# EAGLE design Dicio_bkup (EAGLE 7.5.0)
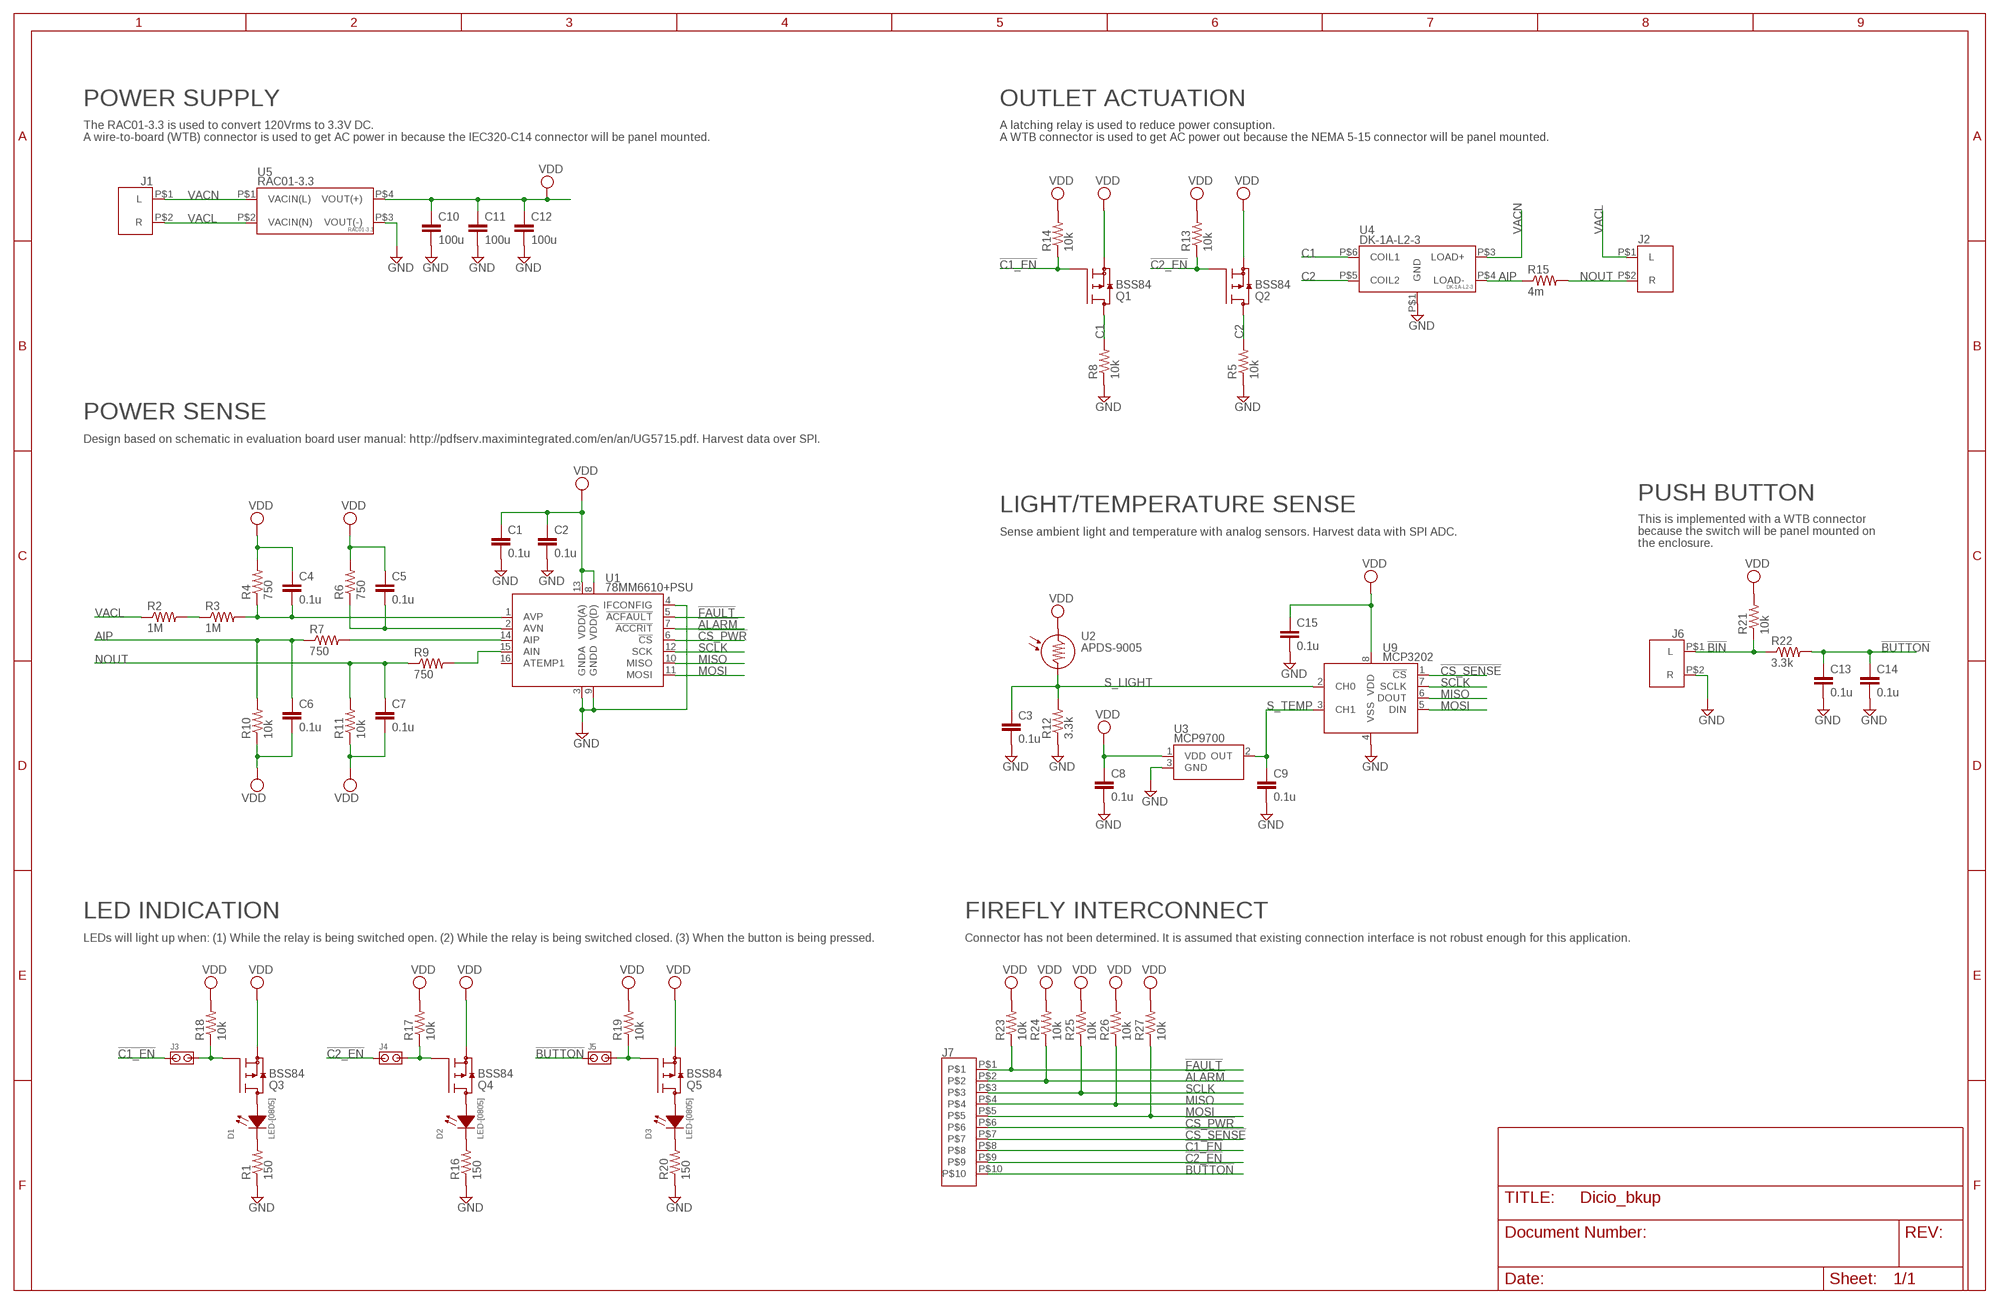
[diagram p0: schematic, sheet 1]

## Parts
C1  0.1u  C-EUC0805  [C0805]
C2  0.1u  C-EUC0805  [C0805]
C3  0.1u  C-EUC0805  [C0805]
C4  0.1u  C-EUC0805  [C0805]
C5  0.1u  C-EUC0805  [C0805]
C6  0.1u  C-EUC0805  [C0805]
C7  0.1u  C-EUC0805  [C0805]
C8  0.1u  C-EUC0805  [C0805]
C9  0.1u  C-EUC0805  [C0805]
C10  100u  C-EUC1206  [C1206]
C11  100u  C-EUC1206  [C1206]
C12  100u  C-EUC1206  [C1206]
C13  0.1u  C-EUC0805  [C0805]
C14  0.1u  C-EUC0805  [C0805]
C15  0.1u  C-EUC0805  [C0805]
D1  LED-[0805]  [L0805]
D2  LED-[0805]  [L0805]
D3  LED-[0805]  [L0805]
J1  WTB-2  [[TERM][2][0.2]]
J2  WTB-2  [[TERM][2][0.2]]
J3  JMP2  [JMP2]
J4  JMP2  [JMP2]
J5  JMP2  [JMP2]
J6  WTB-2  [[TERM][2][0.2]]
J7  TERM10  [TERM10]
Q1  BSS84  [SOT23]
Q2  BSS84  [SOT23]
Q3  BSS84  [SOT23]
Q4  BSS84  [SOT23]
Q5  BSS84  [SOT23]
R1  150  R-US_R0805  [R0805]
R2  1M  R-US_R0805  [R0805]
R3  1M  R-US_R0805  [R0805]
R4  750  R-US_R0805  [R0805]
R5  10k  R-US_R0805  [R0805]
R6  750  R-US_R0805  [R0805]
R7  750  R-US_R0805  [R0805]
R8  10k  R-US_R0805  [R0805]
R9  750  R-US_R0805  [R0805]
R10  10k  R-US_R0805  [R0805]
R11  10k  R-US_R0805  [R0805]
R12  3.3k  R-US_R0805  [R0805]
R13  10k  R-US_R0805  [R0805]
R14  10k  R-US_R0805  [R0805]
R15  4m  R-US_R2512  [R2512]
R16  150  R-US_R0805  [R0805]
R17  10k  R-US_R0805  [R0805]
R18  10k  R-US_R0805  [R0805]
R19  10k  R-US_R0805  [R0805]
R20  150  R-US_R0805  [R0805]
R21  10k  R-US_R0805  [R0805]
R22  3.3k  R-US_R0805  [R0805]
R23  10k  R-US_R0805  [R0805]
R24  10k  R-US_R0805  [R0805]
R25  10k  R-US_R0805  [R0805]
R26  10k  R-US_R0805  [R0805]
R27  10k  R-US_R0805  [R0805]
U1  78MM6610+PSU  [TSSOP16]
U2  APDS-9005  [APDS-9005]
U3  MCP9700  [SOT23]
U4  DK-1A-L2-3  [DK-1A-L2-3]
U5  RAC01-3.3  [RAC01-3.3]
U9  MCP3202  [MSOP-8[MCP3202]]

## Nets
!ALARM!: J7.P$2 R24.1 U1.7(!ACCRIT!)
!BIN!: J6.P$1(L) R21.1 R22.1
!BUTTON!: C13.1 C14.1 J5.P$2 J7.P$10 R22.2
!C1_EN!: J3.P$2 J7.P$8 Q1.1(G) R14.1
!C2_EN!: J4.P$2 J7.P$9 Q2.1(G) R13.1
!CS_PWR!: J7.P$6 U1.6(!CS!)
!CS_SENSE!: J7.P$7 U9.1(!CS!)
!FAULT!: J7.P$1 R23.1 U1.5(!ACFAULT!)
AIP: C6.1 R7.1 R10.2 R15.1 U4.P$4(LOAD-)
C1: Q1.3(D) R8.2 U4.P$6(COIL1)
C2: Q2.3(D) R5.2 U4.P$5(COIL2)
GND: C1.2 C2.2 C3.2 C8.2 C9.2 C10.2 C11.2 C12.2 C13.2 C14.2 C15.2 J6.P$2(R) R1.1 R5.1 R8.1 R12.1 R16.1 R20.1 U1.3(GNDA) U1.4(IFCONFIG) U1.9(GNDD) U3.3(GND) U4.P$1(GND) U5.P$3(VOUT(-)) U9.4(VSS)
MISO: J7.P$4 R26.1 U1.10(MISO) U9.6(DOUT)
MOSI: J7.P$5 R27.1 U1.11(MOSI) U9.5(DIN)
N$1: C4.2 R3.2 R4.1 U1.1(AVP)
N$2: J3.P$1 Q3.1(G) R18.1
N$3: R2.2 R3.1
N$5: D2.1(A) Q4.3(D)
N$6: J4.P$1 Q4.1(G) R17.1
N$7: D1.1(A) Q3.3(D)
N$8: C5.2 R6.1 U1.2(AVN)
N$10: D1.2(C) R1.2
N$11: D2.2(C) R16.2
N$12: J5.P$1 Q5.1(G) R19.1
N$13: D3.1(A) Q5.3(D)
N$14: D3.2(C) R20.2
N$15: R7.2 U1.14(AIP)
N$17: R9.2 U1.15(AIN)
NOUT: C7.1 J2.P$2(R) R9.1 R11.2 R15.2
S_LIGHT: C3.1 R12.2 U2.6(ROUT) U9.2(CH0)
S_TEMP: C9.1 U3.2(OUT) U9.3(CH1)
SCLK: J7.P$3 R25.1 U1.12(SCK) U9.7(SCLK)
VACL: J1.P$2(R) J2.P$1(L) R2.1 U5.P$2(VACIN(N))
VACN: J1.P$1(L) U4.P$3(LOAD+) U5.P$1(VACIN(L))
VDD: C1.1 C2.1 C4.1 C5.1 C6.2 C7.2 C8.1 C10.1 C11.1 C12.1 C15.1 Q1.2(S) Q2.2(S) Q3.2(S) Q4.2(S) Q5.2(S) R4.2 R6.2 R10.1 R11.1 R13.2 R14.2 R17.2 R18.2 R19.2 R21.2 R23.2 R24.2 R25.2 R26.2 R27.2 U1.8(VDD(D)) U1.13(VDD(A)) U2.1(VDD) U3.1(VDD) U5.P$4(VOUT(+)) U9.8(VDD)
Unconnected: U1.16(ATEMP1) U2.2(NC1) U2.3(NC2) U2.4(NC3) U2.5(NC4)

## Notes on the sheet
- POWER SUPPLY | OUTLET ACTUATION
- The RAC01-3.3 is used to convert 120Vrms to 3.3V DC.
  A wire-to-board (WTB) connector is used to get AC power in because the IEC320-C14 connector will be panel mounted.
- A latching relay is used to reduce power consuption.
  A WTB connector is used to get AC power out because the NEMA 5-15 connector will be panel mounted.
- POWER SENSE
- Design based on schematic in evaluation board user manual: http://pdfserv.maximintegrated.com/en/an/UG5715.pdf. Harvest data over SPI.
- PUSH BUTTON
- LIGHT/TEMPERATURE SENSE
- Sense ambient light and temperature with analog sensors. Harvest data with SPI ADC.
- This is implemented with a WTB connector
  because the switch will be panel mounted on 
  the enclosure.
- LED INDICATION | FIREFLY INTERCONNECT
- LEDs will light up when: (1) While the relay is being switched open. (2) While the relay is being switched closed. (3) When the button is being pressed. | Connector has not been determined. It is assumed that existing connection interface is not robust enough for this application.

## Library data of the parts
C1-C9 C13-C15 = resistor:C-EU: CAPACITOR, European symbol; DKPN: 399-1249-1-ND
C10-C12 = resistor:C-EU: CAPACITOR, European symbol; DKPN: 490-7217-1-ND
D1 = TORO:LED-[0805]; COLOR: GREEN; DKPN: 160-1218-1-ND
D2 = TORO:LED-[0805]; COLOR: RED; DKPN: 475-1415-1-ND
D3 = TORO:LED-[0805]; COLOR: YELLOW; DKPN: 475-2560-1-ND
J1 J2 J6 = TORO:WTB-2; DKPN: ED2580-ND
J3-J5 = TORO:JMP2; DKPN: S1011EC-02-ND
J7 = TORO:TERM10
Q1-Q5 = TORO:BSS84; DKPN: BSS84CT-ND
R1 R16 R20 = resistor:R-US_: RESISTOR, American symbol; DKPN: 311-150ARCT-ND
R2 R3 = resistor:R-US_: RESISTOR, American symbol; DKPN: 311-1.00MCRCT-ND
R4 R6 R7 R9 = resistor:R-US_: RESISTOR, American symbol; DKPN: 311-750ARCT-ND
R5 R8 R10 R11 R13 R14 R17-R19 R21 R23-R27 = resistor:R-US_: RESISTOR, American symbol; DKPN: 311-10KARCT-ND
R12 R22 = resistor:R-US_: RESISTOR, American symbol; DKPN: 311-3.30KCRCT-ND
R15 = resistor:R-US_: RESISTOR, American symbol; DKPN: 696-1181-1-ND
U1 = TORO:78MM6610+PSU; DKPN: 78M6610+PSU/C48-ND
U2 = TORO:APDS-9005; DKPN: 516-1717-1-ND
U3 = TORO:MCP9700; DKPN: MCP9700T-E/TTCT-ND
U4 = TORO:DK-1A-L2-3; DKPN: 255-2053-ND
U5 = TORO:RAC01-3.3; DKPN: 945-1400-5-ND
U9 = TORO:MCP3202; DKPN: MCP3202-CI/SN-ND

## Board
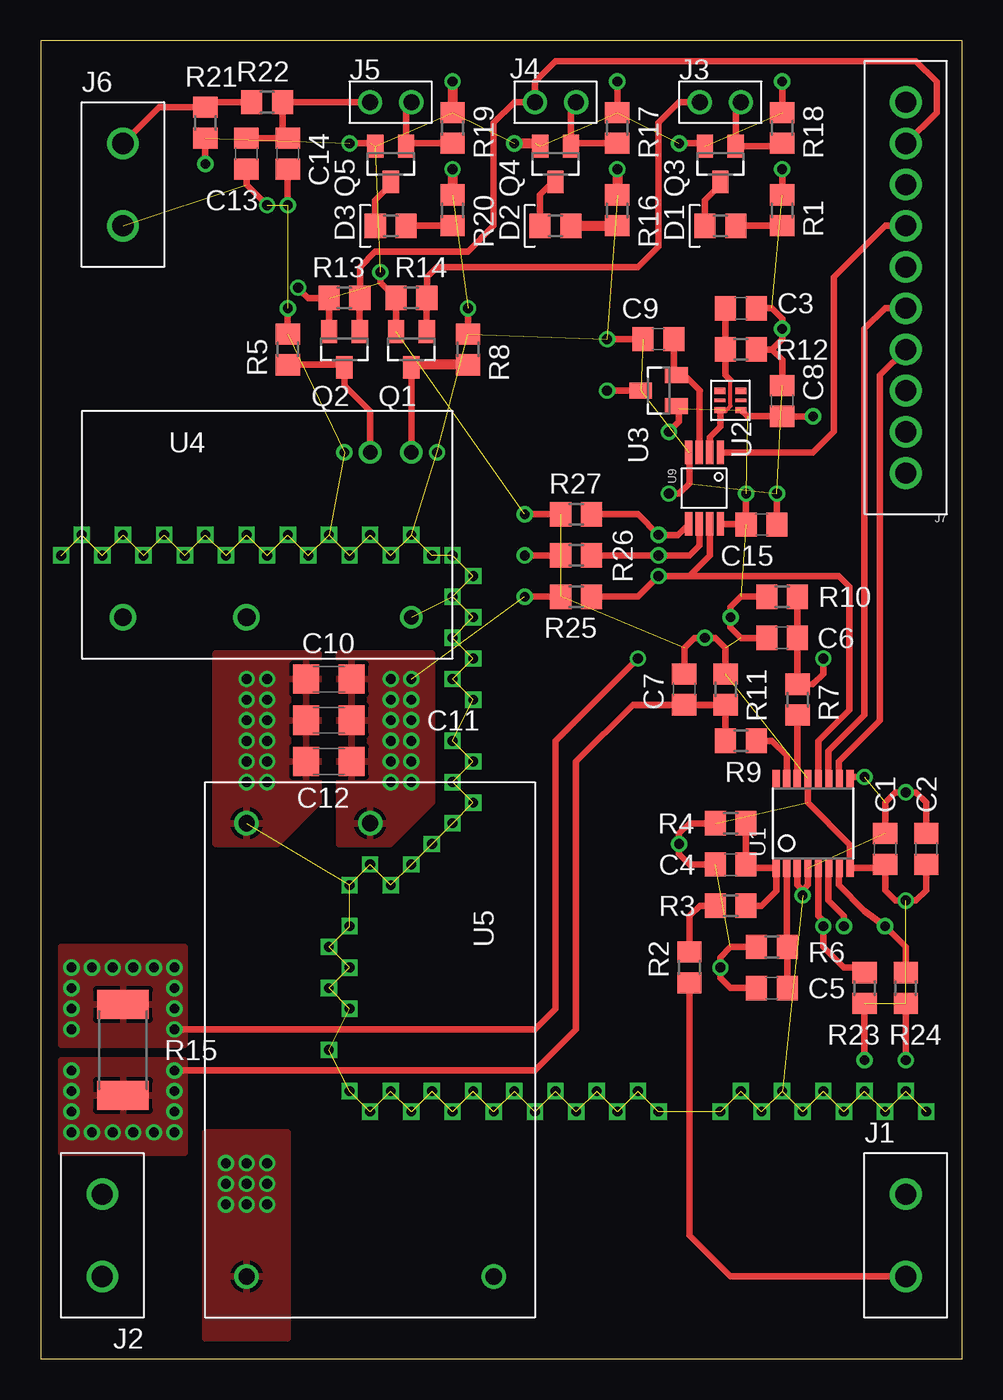
[diagram p1: board, top side]
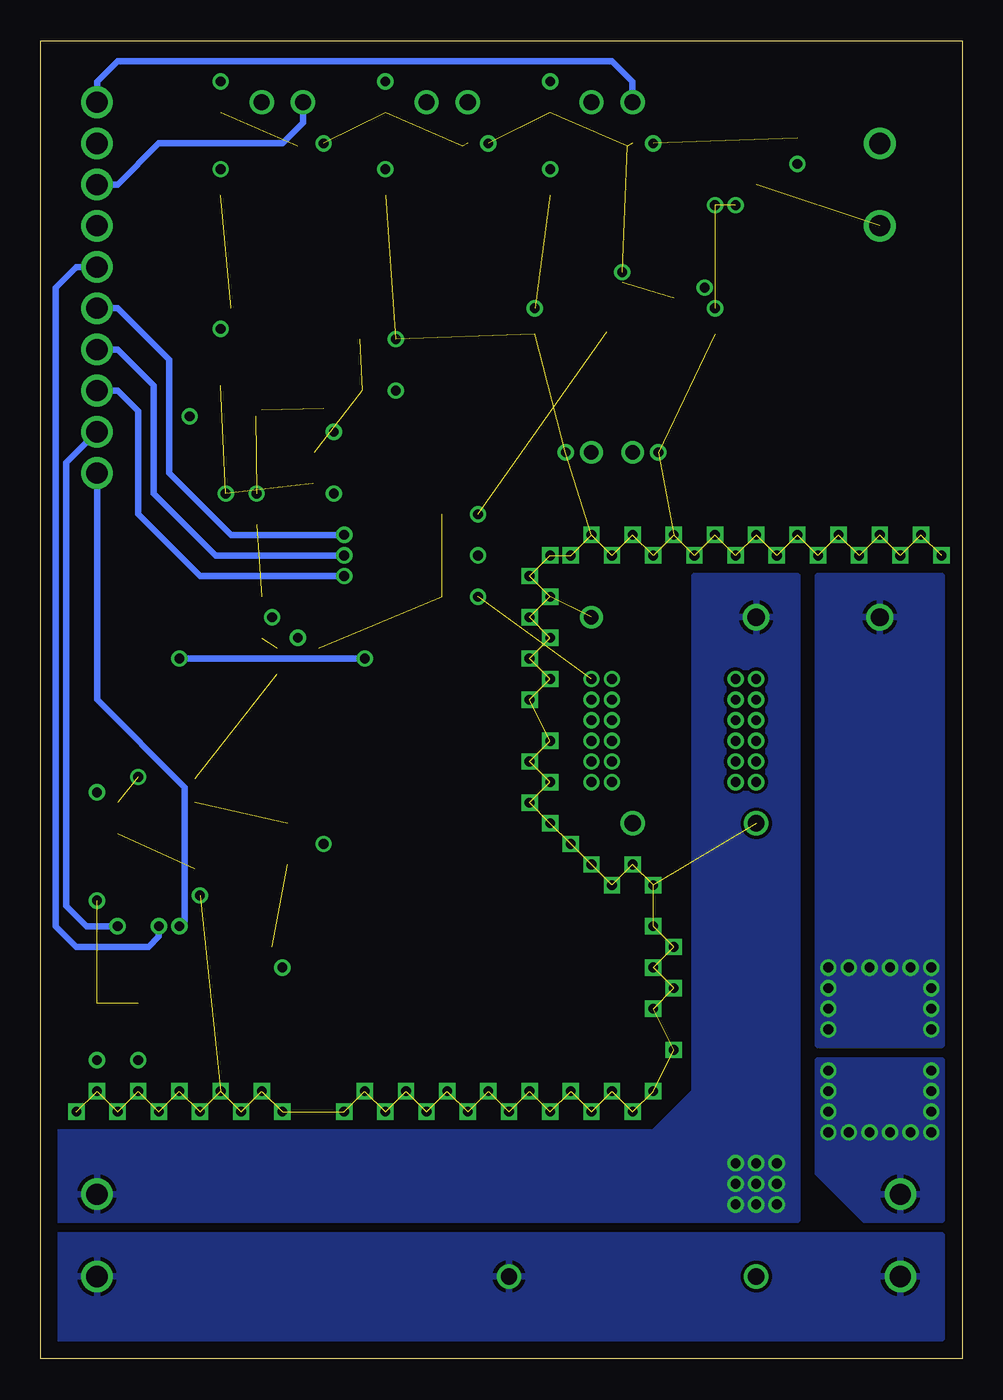
[diagram p2: board, bottom side, seen from below]

Size 56.82 x 81.27 mm. Coordinates in mm from the lower left corner, seen from the top.
Outline: 0,0 56.82,0 56.82,81.27 0,81.27 0,0
Copper layers (1*16): Top 0.035mm / dielectric 1.5mm / Bottom 0.035mm
Design rules "default": minimum track width 10mil, minimum drill 24mil, track to track 8mil, track to pad 8mil, pad to pad 8mil, via to via 8mil, smd to smd 8mil, copper to edge 40mil, drill to drill 8mil, minimum pad ring 10mil, minimum via ring 8mil, stop-mask expansion 4mil, vias tented up to drill 0mil, thermal gap 10mil

### Footprints (pad centres in the part's own frame; a part is rotated, then mirrored left to right if it is on the bottom)
C0805 = smd 1.3 x 1.5: 1 -0.95,0; 2 0.95,0
C1206 = smd 1.6 x 1.8: 1 -1.4,0; 2 1.4,0
L0805 = smd 1.3 x 1.5: 1 -0.95,0; 2 0.95,0
[TERM][2][0.2] = drill 1.3: P$1 0,0; P$2 0,-5.08
JMP2 = drill 0.991: P$1 0,0; P$2 0,-2.54
TERM10 = drill 1.3: P$1 0,0; P$2 0,-2.54; P$3 0,-5.08; P$4 0,-7.62; P$5 0,-10.16; P$6 0,-12.7; P$7 0,-15.24; P$8 0,-17.78; P$9 0,-20.32; P$10 0,-22.86
SOT23 = smd 1 x 1.4: 1 -0.95,-1.1; 2 0.95,-1.1; 3 0,1.1
R0805 = smd 1.3 x 1.5: 1 -0.95,0; 2 0.95,0
R2512 = smd 1.8 x 3.2: 1 -2.8,0; 2 2.8,0
TSSOP16 = smd 0.45 x 1.05: 1 -2.275,-2.768; 2 -1.625,-2.768; 3 -0.975,-2.768; 4 -0.325,-2.768; 5 0.325,-2.768; 6 0.975,-2.768; 7 1.625,-2.768; 8 2.275,-2.768; 9 2.275,2.768; 10 1.625,2.768; 11 0.975,2.768; 12 0.325,2.768; 13 -0.325,2.768; 14 -0.975,2.768; 15 -1.625,2.768; 16 -2.275,2.768
APDS-9005 = smd 0.4 x 0.7: 1 1.2,0; 3 0,0; 6 1.2,-1.3 | smd 0.2 x 0.7: 2 0.6,0; 5 0.6,-1.3 | smd 0.4 x 0.67: 4 0,-1.3
DK-1A-L2-3 = drill 0.889: P$1 0,0; P$5 2.54,-10.16; P$6 0,-10.16 | drill 1.092: P$3 10.16,0; P$4 17.78,0
RAC01-3.3 = drill 1: P$1 0,0; P$2 0,-15.24; P$3 27.94,0; P$4 27.94,-7.62
MSOP-8[MCP3202] = smd 1.45 x 0.45: 1 0,0; 2 0,-0.65; 3 0,-1.3; 4 0,-1.95; 5 4.4,-1.95; 6 4.4,-1.3; 7 4.4,-0.65; 8 4.4,0

### Placement (x,y rotation side)
C1  52.07,31.43 90 top
C2  54.61,31.43 90 top
C3  43.18,64.77 0 top
C4  42.55,30.48 0 top
C5  45.09,22.86 0 top
C6  45.72,44.45 180 top
C7  39.69,41.27 90 top
C8  45.72,59.05 90 top
C9  38.1,62.87 180 top
C10  17.78,41.91 180 top
C11  17.78,39.37 180 top
C12  17.78,36.83 180 top
C13  12.7,74.3 270 top
C14  15.24,74.3 270 top
C15  44.45,51.44 0 top
D1  41.91,69.85 0 top
D2  31.75,69.85 0 top
D3  21.59,69.85 0 top
J1  53.34,10.16 0 top
J2  3.81,5.08 180 top
J3  43.18,77.47 270 top
J4  33.02,77.47 270 top
J5  22.86,77.47 270 top
J6  5.08,74.93 0 top
J7  53.34,54.61 180 top
Q1  22.86,62.23 180 top
Q2  18.73,62.23 180 top
Q3  41.91,73.66 180 top
Q4  31.75,73.66 180 top
Q5  21.59,73.66 180 top
R1  45.72,70.8 270 top
R2  40.01,24.13 90 top
R3  42.55,27.94 0 top
R4  42.55,33.02 180 top
R5  15.24,62.23 270 top
R6  45.09,25.4 180 top
R7  46.67,40.64 270 top
R8  26.35,62.23 270 top
R9  43.18,38.1 0 top
R10  45.72,46.99 0 top
R11  42.23,41.27 270 top
R12  43.18,62.23 180 top
R13  18.73,65.41 180 top
R14  22.86,65.41 180 top
R15  5.08,19.05 270 top
R16  35.56,70.8 270 top
R17  35.56,75.88 90 top
R18  45.72,75.88 90 top
R19  25.4,75.88 90 top
R20  25.4,70.8 270 top
R21  10.16,76.2 270 top
R22  13.97,77.47 0 top
R23  50.8,22.86 270 top
R24  53.34,22.86 270 top
R25  33.02,46.99 180 top
R26  33.02,49.53 180 top
R27  33.02,52.07 180 top
U1  47.62,33.02 0 top
U2  43.18,59.69 270 top
U3  38.1,59.69 90 top
U4  22.86,45.72 180 top
U5  12.7,5.08 90 top
U9  41.91,55.88 270 top

### Tracks (layer width: path | path; a pad name or v marks a point on that pad's centre or on a via)
!ALARM!  (via drill 0.6)
  Top 0.406: U1.7 49.21,30.21 49.21,29.21 50.8,27.62 v52.07,26.67 53.34,25.4 R24.1
  Bottom 0.406: J7.P$2 55.24,55.24 55.24,27.94 53.98,26.67 v52.07,26.67
!BIN!
  Top 0.406: R22.1 10.48,77.47 | R21.1 7.3,77.15 J6.P$1
  Top 0.61: 10.48,77.47 R21.1
!BUTTON!
  Top 0.406: J5.P$2 R22.2 14.92,75.56 | C14.1 C13.1
  Top 0.61: 14.92,75.56 C14.1
  Bottom 0.406: J7.P$10 53.34,78.74 52.07,80.01 21.59,80.01 20.32,78.74 J5.P$2
!C1_EN!
  Top 0.406: R14.1 Q1.1 | J3.P$2 39.37,77.47 38.1,76.2 38.1,68.58 36.83,67.31 24.45,67.31 23.81,66.67 R14.1
  Top 0.61: 23.98,63.5 Q1.1 | R14.1
  Bottom 0.406: J7.P$8 52.07,72.39 49.53,74.93 41.91,74.93 40.64,76.2 J3.P$2
!C2_EN!
  Top 0.406: R13.1 Q2.1 | R13.1 19.68,67.31 20.64,68.26 26.35,68.26 27.94,69.85 27.94,76.2 29.21,77.47 J4.P$2 30.48,78.74 31.75,80.01 53.98,80.01 55.24,78.74 55.24,76.83 J7.P$9
  Top 0.61: R13.1
!CS_PWR!  (via drill 0.6)
  Top 0.406: U1.6 48.58,29.96 48.58,28.26 49.53,27.3 v49.53,26.67
  Bottom 0.406: J7.P$6 54.61,67.31 55.88,66.04 55.88,26.67 54.61,25.4 50.16,25.4 49.53,26.04 v49.53,26.67
!CS_SENSE!
  Top 0.406: J7.P$7 52.07,69.85 48.9,66.67 48.9,57.15 47.62,55.88 U9.1
!FAULT!  (via drill 0.6)
  Top 0.406: U1.5 47.94,27.3 48.26,26.99 v48.26,26.67 48.26,25.4 49.53,24.13 50.8,24.13 R23.1
  Bottom 0.406: U1.5 | U1.5 47.94,27.3 47.94,26.99 48.26,26.35 v48.26,26.67 | J7.P$1 53.34,40.64 47.94,35.24 U1.5
AIP  (via drill 0.6)
  Top 0.406: R10.2 C6.1 46.67,41.91 46.35,41.91 R7.1 47.62,41.59 48.26,42.23 v48.26,43.18 | v8.26,20.32 30.48,20.32 31.75,21.59 31.75,38.1 v36.83,43.18
  Bottom 0.406: v36.83,43.18 v48.26,43.18
  other vias: 1.91,21.59 1.91,20.32 1.91,22.86 1.91,24.13 3.17,24.13 4.45,24.13 5.71,24.13 6.99,24.13 8.26,24.13 8.26,22.86 8.26,21.59
  pour Bottom: 1.27,19.37 8.89,19.37 8.89,48.26 1.27,48.26
  pour Top: 1.27,19.37 1.27,25.4 8.89,25.4 8.89,19.37
C1
  Top 0.406: Q1.3 U4.P$6
  Top 0.61: R8.2 23.01,61.28 Q1.3
C2
  Top 0.406: R5.2 18.58,61.28 | Q2.3 18.73,60.01 20.32,58.42 U4.P$5
  Top 0.61: 18.58,61.28 Q2.3
GND  (via drill 0.6)  (89 unrouted)
  Top 0.406: C14.2 v15.24,71.12 | R1.1 v45.72,73.34 | R5.1 v15.24,64.77 | R8.1 v26.35,64.77 | C13.2 12.7,72.39 v13.97,71.12 | C9.2 v34.92,62.87 | U3.3 v34.92,59.69 | U9.4 40.01,55.84 40.01,53.98 39.37,53.34 v38.73,53.34 | C15.2 v45.4,53.34 | C3.2 45.09,64.77 45.72,64.14 v45.72,63.5 45.72,62.87 45.09,62.23 | R12.1 45.09,62.23 | 45.09,62.23 45.72,61.59 C8.2 | U1.3 46.67,30.23 46.67,29.21 46.99,28.89 | U1.4 47.31,29.21 46.99,28.89 | 46.99,28.89 v46.99,28.57 | C2.2 54.61,34.29 53.98,34.92 v53.34,34.92 52.7,34.92 52.07,34.29 C1.2 | U1.9 49.99,35.88 v50.8,35.88
  Top 0.61: v25.4,73.34 R20.1 | v35.56,73.34 R16.1
  other vias: 18.73,55.88 24.45,55.88 13.97,41.91 13.97,40.64 13.97,39.37 13.97,38.1 13.97,36.83 12.7,36.83 12.7,38.1 12.7,39.37 12.7,40.64 12.7,41.91 12.7,35.56 13.97,35.56 54.61,15.24 53.34,16.51 52.07,15.24 50.8,16.51 49.53,15.24 48.26,16.51 46.99,15.24 44.45,15.24 45.72,16.51 43.18,16.51 41.91,15.24 38.1,15.24 36.83,16.51 35.56,15.24 33.02,15.24 34.29,16.51 30.48,15.24 31.75,16.51 29.21,16.51 27.94,15.24 26.67,16.51 25.4,15.24 24.13,16.51 22.86,15.24 21.59,16.51 20.32,15.24 19.05,16.51 17.78,19.05 17.78,22.86 19.05,21.59 19.05,24.13 17.78,25.4 19.05,26.67 19.05,29.21 20.32,30.48 21.59,29.21 24.13,31.75 26.67,34.29 25.4,35.56 26.67,36.83 25.4,38.1 26.67,40.64 25.4,41.91 26.67,43.18 25.4,44.45 16.51,49.53 15.24,50.8 13.97,49.53 12.7,50.8 11.43,49.53 10.16,50.8 8.89,49.53 7.62,50.8 6.35,49.53 5.08,50.8 3.81,49.53 2.54,50.8 1.27,49.53 26.67,45.72 25.4,46.99 26.67,48.26 25.4,49.53 22.86,50.8 24.13,49.53 21.59,49.53 20.32,50.8 19.05,49.53 25.4,33.02 22.86,30.48 17.78,50.8
  pour Top: 17.14,34.29 17.14,43.5 10.79,43.5 10.79,31.75 14.61,31.75
MISO  (via drill 0.6)
  Top 0.406: R26.1 v38.1,49.53 40.01,49.53 40.61,50.13 U9.6 | U1.10 49.21,35.83 49.21,36.83 51.75,39.37 51.75,60.64 J7.P$4
  Bottom 0.406: J7.P$4 52.07,62.23 49.85,60.01 49.85,53.34 46.04,49.53 v38.1,49.53
MOSI  (via drill 0.6)
  Top 0.406: R27.1 36.83,52.07 v38.1,50.8 39.28,50.8 U9.5 | U1.11 48.58,35.81 48.58,37.47 50.8,39.69 50.8,63.5 52.07,64.77 J7.P$5
  Bottom 0.406: J7.P$5 52.07,64.77 48.9,61.59 48.9,54.61 45.09,50.8 v38.1,50.8
N$1
  Top 0.406: R3.2 44.45,27.94 45.35,28.84 U1.1 44.04,30.25 43.81,30.48 C4.2 R4.1
N$2
  Top 0.406: J3.P$1 42.86,77.15 Q3.1 45.55,74.76
  Top 0.61: 45.55,74.76 R18.1
N$3
  Top 0.406: R3.1 40.64,27.94 40.01,27.3 R2.2
N$5
  Top 0.406: 31.6,72.56 30.8,71.75 D2.1
  Top 0.61: Q4.3 31.6,72.56 | D2.1
N$6
  Top 0.406: R17.1 32.87,74.93 | Q4.1 32.7,77.15 J4.P$1
  Top 0.61: 32.87,74.93 Q4.1
N$7
  Top 0.406: 41.91,72.39 40.96,71.44 D1.1
  Top 0.61: Q3.3 41.91,72.39 | D1.1
N$8
  Top 0.406: C5.2 R6.1 46,25.43 U1.2
N$10
  Top 0.406: D1.2 R1.2
  Top 0.61: R1.2
N$11
  Top 0.61: D2.2 R16.2
N$12
  Top 0.406: Q5.1 22.54,77.15 J5.P$1 | R19.1 22.71,74.93
  Top 0.61: 22.71,74.93 Q5.1
N$13
  Top 0.406: 21.59,72.39 20.64,71.44 D3.1
  Top 0.61: Q5.3 21.59,72.39 | D3.1
N$14
  Top 0.406: D3.2 R20.2
  Top 0.61: R20.2
N$15
  Top 0.406: U1.14 46.67,35.81 R7.2
N$17
  Top 0.406: 46.04,35.83 U1.15 46,37.19 45.09,38.1 R9.2
NOUT  (via drill 0.6)
  Top 0.406: R9.1 42.23,39.05 42.23,39.37 R11.2 C7.1 36.52,40.33 33.02,36.83 33.02,20.32 30.48,17.78 v8.26,17.78
  other vias: 1.91,17.78 1.91,16.51 1.91,15.24 1.91,13.97 3.17,13.97 4.45,13.97 5.71,13.97 6.99,13.97 8.26,13.97 8.26,15.24 8.26,16.51
  pour Bottom: 8.89,18.41 1.27,18.41 1.27,8.57 6.03,8.57 8.89,11.43
  pour Top: 1.27,18.41 1.27,12.7 8.89,12.7 8.89,18.41
S_LIGHT
  Top 0.254: 41.91,58.46 41.91,58.42 42.23,58.42 42.55,58.74 42.55,60.33
  Top 0.406: 42.55,60.33 42.23,60.64 42.23,60.65 R12.2 C3.1 | U2.6 41.91,58.46 41.91,57.47 41.26,56.82 U9.2
S_TEMP
  Top 0.406: C9.1 39.05,60.79 U3.2 39.69,60.64 40.64,59.69 40.61,59.66 U9.3
SCLK  (via drill 0.6)
  Top 0.406: R25.1 36.83,46.99 v38.1,48.26 40.01,48.26 | U9.7 41.27,51.47 41.27,49.53 40.01,48.26 | U1.12 47.94,38.1 49.85,40.01 49.85,47.62 49.21,48.26 40.01,48.26
  Bottom 0.406: J7.P$3 52.07,59.69 50.8,58.42 50.8,52.07 46.99,48.26 v38.1,48.26
VACL
  Top 0.406: R2.1 40.01,7.62 42.55,5.08 J1.P$2
  pour Bottom: 55.88,1.27 1.27,1.27 1.27,7.62 55.88,7.62
VACN  (via drill 0.6)
  other vias: 12.7,9.53 11.43,9.53 13.97,9.53 11.43,10.79 12.7,10.79 13.97,10.79 13.97,12.06 12.7,12.06 11.43,12.06
  pour Bottom: 10.16,48.26 10.16,8.57 55.88,8.57 55.88,13.97 19.05,13.97 16.51,16.51 16.51,48.26
  pour Top: 10.16,13.97 10.16,1.27 15.24,1.27 15.24,13.97
VDD  (via drill 0.6)  (24 unrouted)
  Top 0.406: Q2.2 R13.2 16.51,65.41 v15.88,66.04 | Q1.2 R14.2 20.95,66.36 v20.95,66.99 | v19.05,74.93 20.32,74.93 | R17.2 v35.56,78.74 | v39.37,74.93 40.79,74.93 | R18.2 v45.72,78.74 | R21.2 v10.16,73.66 | U3.1 39.37,58.57 39.37,57.78 v38.73,57.15 | U9.8 43.45,51.48 C15.1 43.5,53.02 v43.5,53.34 | U2.1 43.56,58.1 C8.1 v47.62,58.1 | U1.13 47.31,34.29 49.9,31.7 U1.8 51.84,30.25 | C5.1 42.55,22.86 41.91,23.5 v41.91,24.13 41.91,24.77 42.55,25.4 R6.2 | C2.1 54.61,29.21 54.61,28.89 53.98,28.26 v53.34,28.26 52.7,28.26 52.07,28.89 C1.1 51.84,30.25 | C4.1 40.01,30.48 39.37,31.11 v39.37,31.75 39.37,32.38 40.01,33.02 41.27,33.02 41.27,32.7 R4.2 | C6.2 43.18,44.45 42.55,45.09 v42.55,45.72 42.55,46.35 43.18,46.99 R10.1 | R11.1 42.23,43.81 41.59,44.45 v40.96,44.45 40.32,44.45 39.69,43.81 C7.2 | 51.84,30.25 52.07,30.02 | R23.2 v50.8,18.41 | R24.2 v53.34,18.41 | R27.2 v29.84,52.07 | R26.2 v29.84,49.53 | R25.2 v29.84,46.99
  Top 0.61: v25.4,78.74 R19.2 | v29.21,74.93 30.48,74.93 | 40.79,74.93 Q3.2
  other vias: 21.59,41.91 21.59,40.64 21.59,39.37 21.59,38.1 21.59,36.83 22.86,36.83 22.86,38.1 22.86,39.37 22.86,40.64 21.59,35.56 22.86,35.56 22.86,41.91
  pour Top: 18.41,31.75 21.59,31.75 24.13,34.29 24.13,43.5 18.41,43.5
  pour Top: 18.41,31.75 21.59,31.75 24.13,34.29 24.13,43.5 18.41,43.5